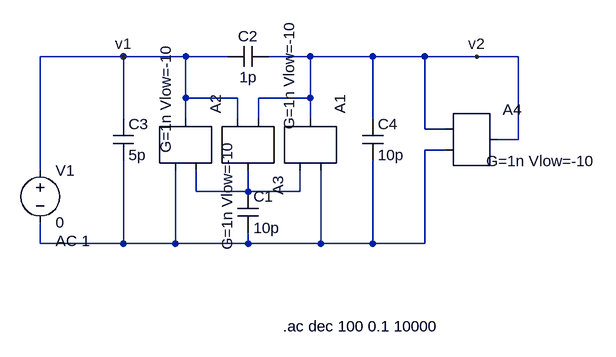
[diagram p0: schematic Draft1.asc]
Draft1.asc, the LTspice schematic file:
Version 4
SHEET 1 880 680
WIRE -304 -48 -432 -48
WIRE -208 -48 -304 -48
WIRE -144 -48 -208 -48
WIRE -16 -48 -80 -48
WIRE 80 -48 -16 -48
WIRE 160 -48 80 -48
WIRE 240 -48 160 -48
WIRE 304 -48 240 -48
WIRE -208 16 -208 -48
WIRE -128 16 -208 16
WIRE -16 16 -16 -48
WIRE -16 16 -96 16
WIRE -304 48 -304 -48
WIRE -208 48 -208 16
WIRE -128 48 -128 16
WIRE -96 48 -96 16
WIRE -16 48 -16 16
WIRE 80 48 80 -48
WIRE 160 64 160 -48
WIRE 192 64 160 64
WIRE 304 80 304 -48
WIRE 304 80 272 80
WIRE 192 96 160 96
WIRE -432 128 -432 -48
WIRE -192 160 -192 128
WIRE -112 160 -112 128
WIRE -112 160 -192 160
WIRE -32 160 -32 128
WIRE -32 160 -112 160
WIRE -432 240 -432 208
WIRE -304 240 -304 112
WIRE -304 240 -432 240
WIRE -224 240 -224 128
WIRE -224 240 -304 240
WIRE -112 240 -112 224
WIRE -112 240 -224 240
WIRE 0 240 0 128
WIRE 0 240 -112 240
WIRE 80 240 80 112
WIRE 80 240 0 240
WIRE 160 240 160 96
WIRE 160 240 80 240
FLAG 240 -48 v2
FLAG -304 -48 v1
SYMBOL SpecialFunctions\\ota 48 96 M270
WINDOW 3 31 97 Left 2
SYMATTR InstName A1
SYMATTR Value G=1n Vlow=-10
SYMBOL voltage -432 112 R0
WINDOW 123 24 124 Left 2
WINDOW 39 0 0 Left 0
SYMATTR InstName V1
SYMATTR Value 0
SYMATTR Value2 AC 1
SYMBOL SpecialFunctions\\ota -144 96 M270
WINDOW 3 -5 95 Left 2
SYMATTR InstName A2
SYMATTR Value G=1n Vlow=-10
SYMBOL SpecialFunctions\\ota -48 80 R90
WINDOW 3 2 96 Left 2
SYMATTR InstName A3
SYMATTR Value G=1n Vlow=-10
SYMBOL cap -128 160 R0
SYMATTR InstName C1
SYMATTR Value 10p
SYMBOL cap -80 -64 R90
WINDOW 0 0 32 VBottom 2
WINDOW 3 32 32 VTop 2
SYMATTR InstName C2
SYMATTR Value 1p
SYMBOL cap -320 48 R0
SYMATTR InstName C3
SYMATTR Value 5p
SYMBOL cap 64 48 R0
SYMATTR InstName C4
SYMATTR Value 10p
SYMBOL SpecialFunctions\\ota 224 16 R0
WINDOW 3 31 97 Left 2
SYMATTR InstName A4
SYMATTR Value G=1n Vlow=-10
TEXT -58 368 Left 2 !.ac dec 100 0.1 10000

The netlist it stands for:
* Draft1.asc
A1 N001 N002 0 0 0 0 v2 0 OTA G=1n Vlow=-10
V1 v1 N001 0 AC 1
A2 N002 N001 0 0 0 0 v1 0 OTA G=1n Vlow=-10
A3 v2 v1 0 0 0 0 N002 0 OTA G=1n Vlow=-10
C1 N002 N001 10p
C2 v2 v1 1p
C3 v1 N001 5p
C4 v2 N001 10p
A4 v2 N001 0 0 0 0 v2 0 OTA G=1n Vlow=-10
.ac dec 100 0.1 10000
.backanno
.end

* Results of the author's LTspice run, read from the files saved beside the schematic
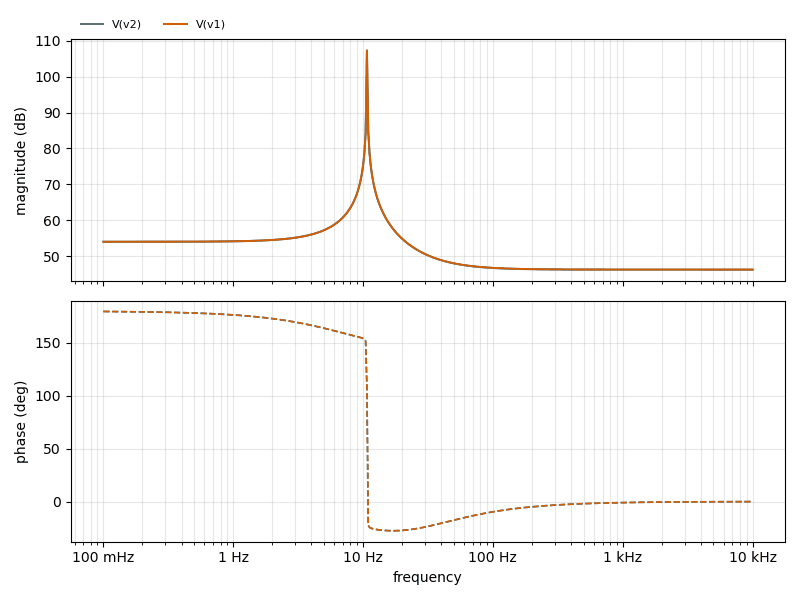
[diagram p1: AC Analysis of Draft1.asc, plotted from the saved traces]
* AC Analysis, 1 run:
*   V(v2): 53.98 dB at 100 mHz, 46.21 dB at 10 kHz, peak 107.30 dB at 10.72 Hz, 3 dB below the peak at 10.68 Hz and 10.75 Hz
*   V(v1): 53.99 dB at 100 mHz, 46.25 dB at 10 kHz, peak 107.32 dB at 10.72 Hz, 3 dB below the peak at 10.68 Hz and 10.75 Hz